# Altium schematic sheet USBC-US-100W-PD.SchDoc
size A3; SheetNumber: 1; SheetTotal: 4
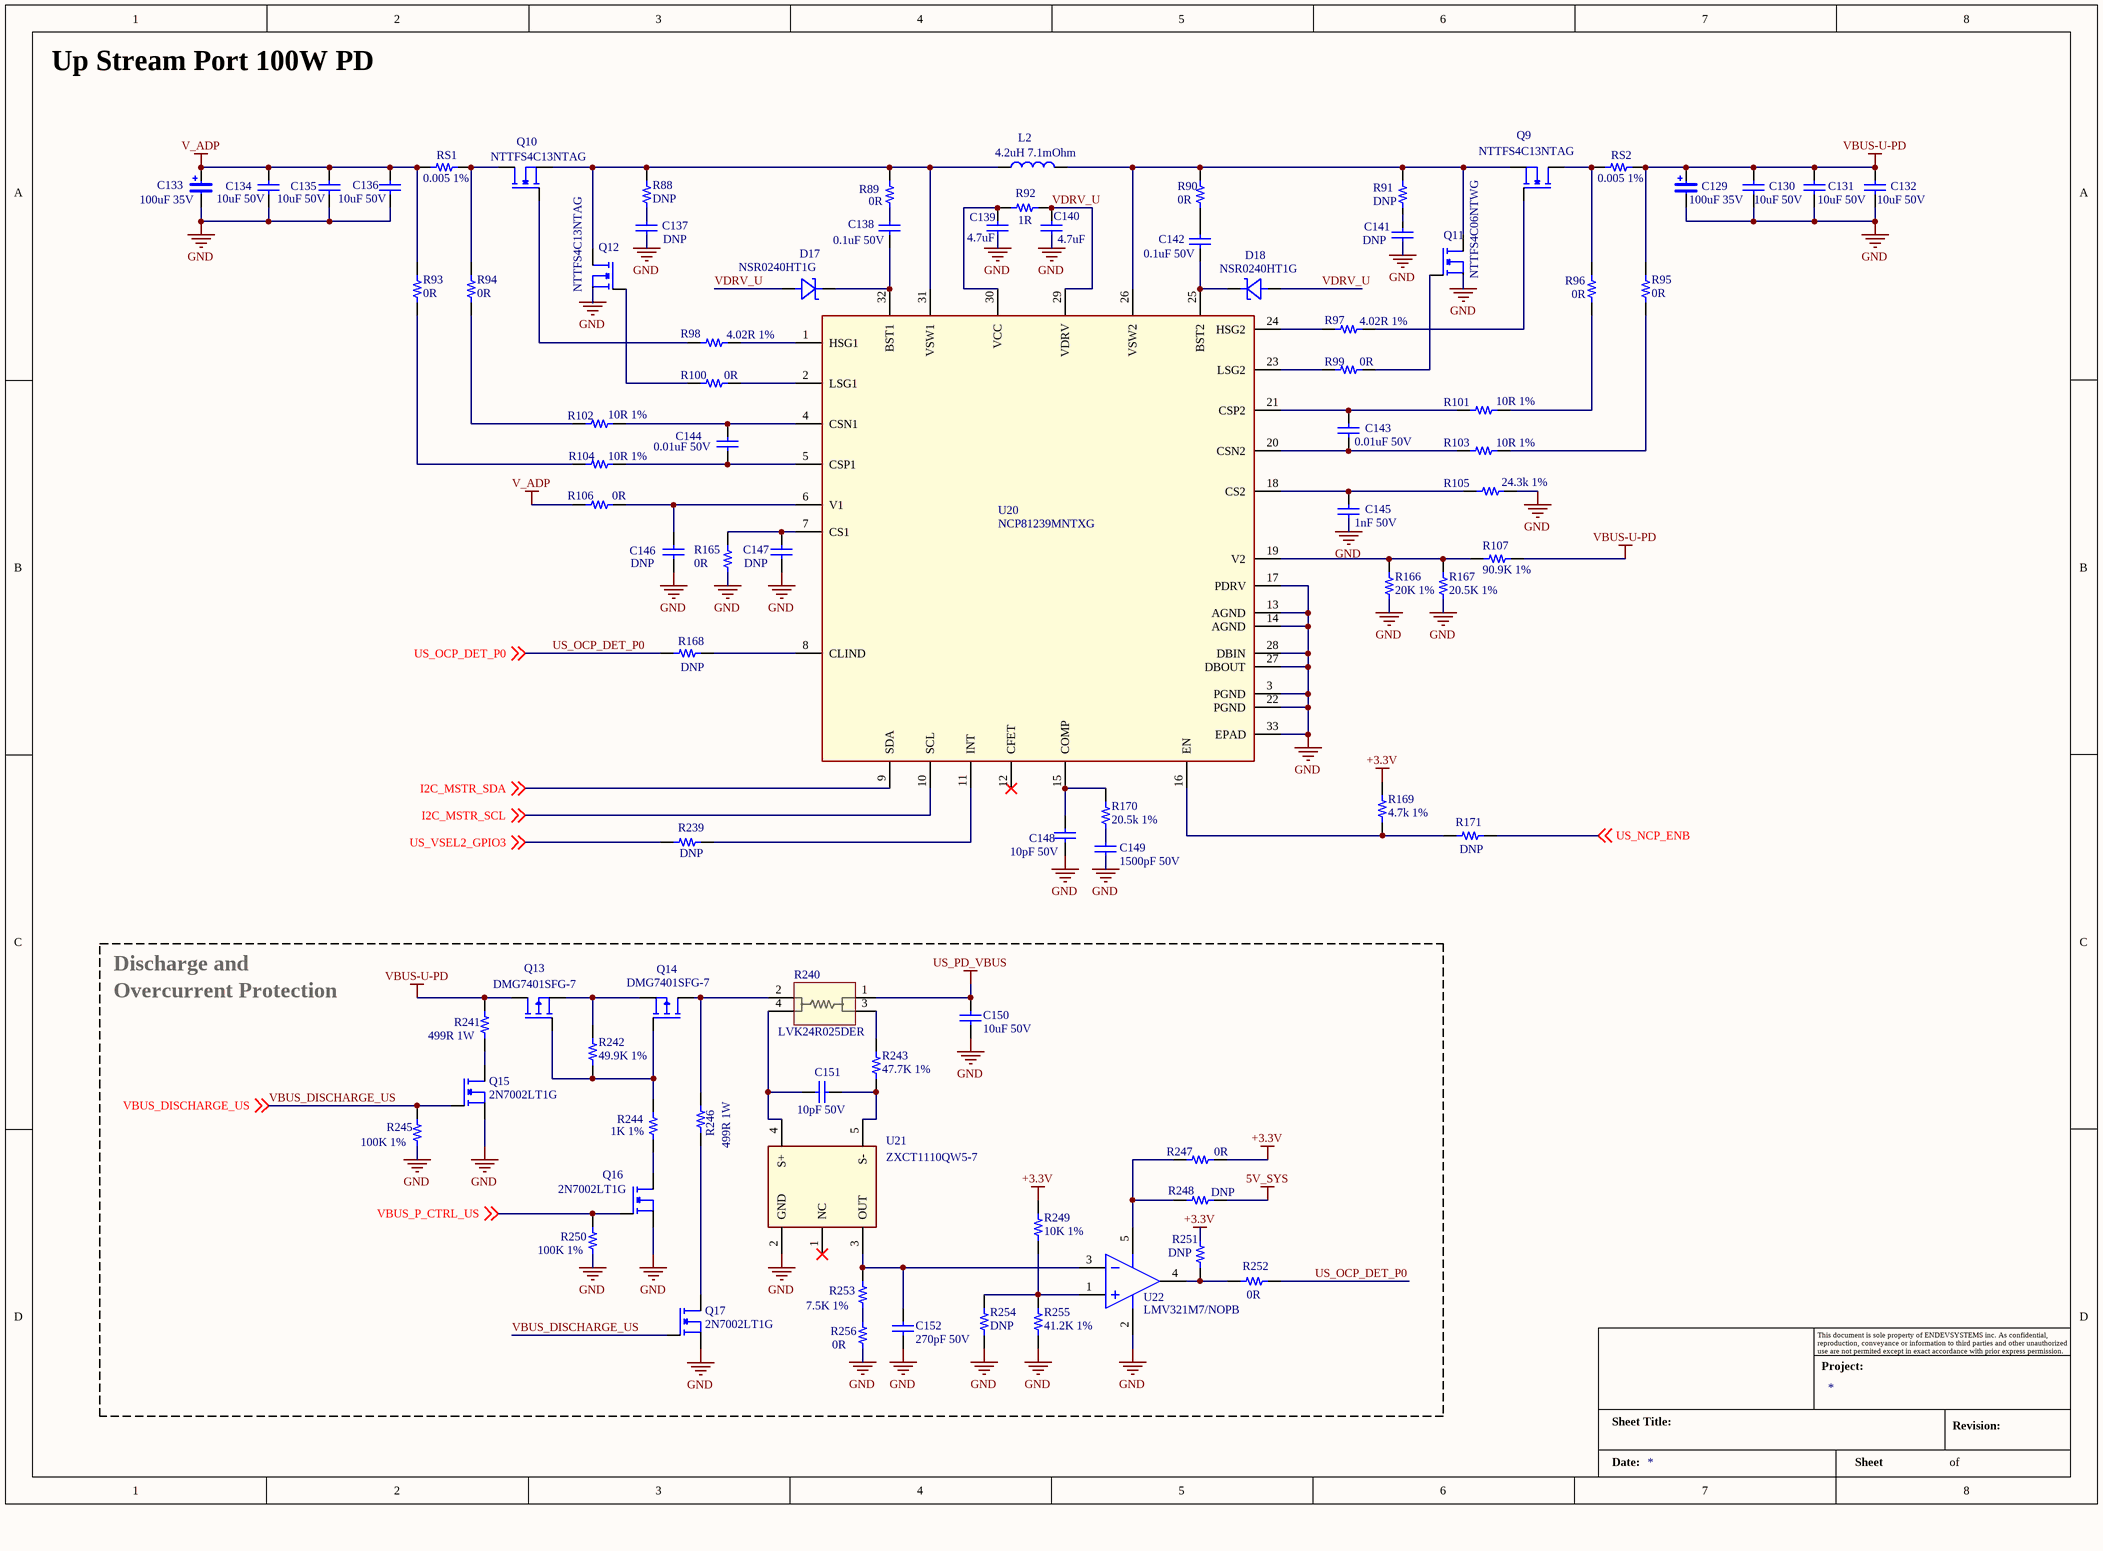
[diagram p0: USBC-US-100W-PD.SchDoc]

## Parts
?  Title_Block  (value not drawn)  (graphical)
C129  100uF 35V  [C-1206 (Tantalum)]
C130  10uF 50V  [C-0402/1005]
C131  10uF 50V  [C-0402/1005]
C132  10uF 50V  [C-0402/1005]
C133  100uF 35V  [C-1206 (Tantalum)]
C134  10uF 50V  [C-0402/1005]
C135  10uF 50V  [C-0402/1005]
C136  10uF 50V  [C-0402/1005]
C137  DNP  [C-0402/1005]
C138  0.1uF 50V  [C-0402/1005]
C139  4.7uF  [C-0402/1005]
C140  4.7uF  [C-0402/1005]
C141  DNP  [C-0402/1005]
C142  0.1uF 50V  [C-0402/1005]
C143  0.01uF 50V  [C-0402/1005]
C144  0.01uF 50V  [C-0402/1005]
C145  1nF 50V  [C-0402/1005]
C146  DNP  [C-0402/1005]
C147  DNP  [C-0402/1005]
C148  10pF 50V  [C-0402/1005]
C149  1500pF 50V  [C-0402/1005]
C150  value 10uF 50V  [C-0402/1005]  (hidden comment: 0.1uF)
C151  value 10pF 50V  [C-0402/1005]  (hidden comment: 0.1uF)
C152  value 270pF 50V  [C-0402/1005]  (hidden comment: 0.1uF)
D17  NSR0240HT1G  [SOIC-8 (W3.9mm) B]
D18  NSR0240HT1G  [SOIC-8 (W3.9mm) B]
L2  4.2uH 7.1mOhm  [4.3x4.3mm]
Q9  NTTFS4C13NTAG
Q10  NTTFS4C13NTAG
Q11  NTTFS4C06NTWG
Q12  NTTFS4C13NTAG
Q13  DMG7401SFG-7
Q14  DMG7401SFG-7
Q15  2N7002LT1G
Q16  2N7002LT1G
Q17  2N7002LT1G
R88  DNP  [R-0402]
R89  0R  [R-0402]
R90  0R  [R-0402]
R91  DNP  [R-0402]
R92  1R  [R-0402]
R93  0R  [R-0402]
R94  0R  [R-0402]
R95  0R  [R-0402]
R96  0R  [R-0402]
R97  4.02R 1%  [R-0402]
R98  4.02R 1%  [R-0402]
R99  0R  [R-0402]
R100  0R  [R-0402]
R101  10R 1%  [R-0402]
R102  10R 1%  [R-0402]
R103  10R 1%  [R-0402]
R104  10R 1%  [R-0402]
R105  24.3k 1%  [R-0402]
R106  0R  [R-0402]
R107  90.9K 1%  [R-0402]
R165  0R  [R-0402]
R166  20K 1%  [R-0402]
R167  20.5K 1%  [R-0402]
R168  DNP  [R-0402]
R169  4.7k 1%  [R-0402]
R170  20.5k 1%  [R-0402]
R171  DNP  [R-0402]
R239  DNP  [R-0402]
R240  LVK24R025DER  [LVK24_OHM]
R241  499R 1W  [R-0402]
R242  49.9K 1%  [R-0402]
R243  47.7K 1%  [R-0402]
R244  1K 1%  [R-0402]
R245  100K 1%  [R-0402]
R246  499R 1W  [R-0402]
R247  0R  [R-0402]
R248  DNP  [R-0402]
R249  10K 1%  [R-0402]
R250  100K 1%  [R-0402]
R251  DNP  [R-0402]
R252  0R  [R-0402]
R253  7.5K 1%  [R-0402]
R254  DNP  [R-0402]
R255  41.2K 1%  [R-0402]
R256  0R  [R-0402]
RS1  0.005 1%  [R-0402]
RS2  0.005 1%  [R-0402]
U20  NCP81239MNTXG  [QFN32_5X5_ONS]
U21  ZXCT1110QW5-7  [MSOP-10-W3mm]
U22  LMV321M7/NOPB  [DCK0005A_M]

## Nets
5V_SYS: R248.1
+3.3V: R169.1 R247.1 R249.2 R251.2
GND: C129.- C130.1 C131.1 C132.1 C133.- C134.1 C135.1 C136.1 C137.1 C139.1 C140.1 C141.1 C145.1 C146.1 C147.1 C148.1 C149.1 C150.2 C152.2 Q11.2(S) Q12.2(S) Q15.2(S) Q16.2(S) Q17.2(S) R105.2 R165.2 R166.2 R167.2 R245.1 R250.1 R254.1 R255.1 R256.1 U20.3(PGND) U20.13(AGND) U20.14(AGND) U20.17(PDRV) U20.22(PGND) U20.27(DBOUT) U20.28(DBIN) U20.33(EPAD) U21.2(GND) U22.2(V-)
US_PD_VBUS: C150.1 R240.1(E1)
V_ADP: C133.+ C134.2 C135.2 C136.2 R93.1 R106.2 RS1.1
VBUS-U-PD: C129.+ C130.2 C131.2 C132.2 Q13.3 R95.2 R107.2 R241.2 RS2.2
I2C_MSTR_SCL: U20.10(SCL) ; off-sheet I2C_MSTR_SCL
I2C_MSTR_SDA: U20.9(SDA) ; off-sheet I2C_MSTR_SDA
US_NCP_ENB: R171.2 ; off-sheet US_NCP_ENB
US_OCP_DET_P0: R168.2 R252.1 ; off-sheet US_OCP_DET_P0
US_VSEL2_GPIO3: R239.2 ; off-sheet US_VSEL2_GPIO3
VBUS_DISCHARGE_US: Q15.1(G) Q17.1(G) R245.2 ; off-sheet VBUS_DISCHARGE_US
VBUS_P_CTRL_US: Q16.1(G) R250.2 ; off-sheet VBUS_P_CTRL_US
VDRV_U: C140.2 D17.A D18.A R92.1 U20.29(VDRV)
NetC137_2: C137.2 R88.1
NetC138_1: C138.1 D17.C U20.32(BST1)
NetC138_2: C138.2 R89.1
NetC139_2: C139.2 R92.2 U20.30(VCC)
NetC141_2: C141.2 R91.1
NetC142_1: C142.1 D18.C U20.25(BST2)
NetC142_2: C142.2 R90.1
NetC143_1: C143.1 R103.2 U20.20(CSN2)
NetC143_2: C143.2 R101.2 U20.21(CSP2)
NetC144_1: C144.1 R104.1 U20.5(CSP1)
NetC144_2: C144.2 R102.1 U20.4(CSN1)
NetC145_2: C145.2 R105.1 U20.18(CS2)
NetC146_2: C146.2 R106.1 U20.6(V1)
NetC147_2: C147.2 R165.1 U20.7(CS1)
NetC148_2: C148.2 R170.1 U20.15(COMP)
NetC149_2: C149.2 R170.2
NetC151_1: C151.1 R243.1 U21.5(S-)
NetC151_2: C151.2 R240.4 U21.4(S+)
NetC152_1: C152.1 R253.2 U21.3(OUT) U22.3(IN-)
NetL2_1: L2.1 Q10.2(S) Q12.3(D) R88.2 R89.2 U20.31(VSW1)
NetL2_2: L2.2 Q9.2(S) Q11.3(D) R90.2 R91.2 U20.26(VSW2)
NetQ9_1: Q9.1(G) R97.1
NetQ9_3: Q9.3(D) R96.2 RS2.1
NetQ10_1: Q10.1(G) R98.2
NetQ10_3: Q10.3(D) R94.1 RS1.2
NetQ11_1: Q11.1(G) R99.1
NetQ12_1: Q12.1(G) R100.2
NetQ13_1: Q13.1 Q14.1 R242.1 R244.2
NetQ13_2: Q13.2 Q14.2 R242.2
NetQ14_3: Q14.3 R240.2(E2) R246.2
NetQ15_3: Q15.3(D) R241.1
NetQ16_3: Q16.3(D) R244.1
NetQ17_3: Q17.3(D) R246.1
NetR93_2: R93.2 R104.2
NetR94_2: R94.2 R102.2
NetR95_1: R95.1 R103.1
NetR96_1: R96.1 R101.1
NetR97_2: R97.2 U20.24(HSG2)
NetR98_1: R98.1 U20.1(HSG1)
NetR99_2: R99.2 U20.23(LSG2)
NetR100_1: R100.1 U20.2(LSG1)
NetR107_1: R107.1 R166.1 R167.1 U20.19(V2)
NetR168_1: R168.1 U20.8(CLIND)
NetR169_2: R169.2 R171.1 U20.16(EN)
NetR239_1: R239.1 U20.11(INT)
NetR240_3: R240.3 R243.2
NetR247_2: R247.2 R248.2 U22.5(V+)
NetR249_1: R249.1 R254.2 R255.2 U22.1(IN+)
NetR251_1: R251.1 R252.2 U22.4(OUT)
NetR253_1: R253.1 R256.2

Not connected (* = marked no-connect by the designer): U20 12(CFET)*; U21 1(NC)*

## Notes on the sheet
- Up Stream Port 100W PD
- Discharge and
- Overcurrent Protection
- (in symbol Title_Block) This document is sole property of ENDEVSYSTEMS inc. As confidential, reproduction, conveyance or information to third parties and other unauthorized use are not permited except in exact accordance with prior express permission.; Project:; Sheet Title:; Revision:; Date:; Sheet; of

## Library data of the parts
C129 C133 = Capacitor-Polar: CAP TANT 10UF 10% 16V 1206; Mfr. Part No.: F931C106KAAAJ6; Unit Price (USD): 0.67; Value: 10uF 16V; Supplier Part No.: 478-10723-1-ND; Supplier: Digikey Electronics
C130-C132 C134-C137 C139-C141 C143-C149 = Cap: Capacitor; Value: 0.1uF; Published: 8-Jun-2000; LatestRevisionDate: 17-Jul-2002; LatestRevisionNote: Re-released for DXP Platform.; PackageReference: RAD-0.3; Publisher: Altium Limited; PackageDescription: Radial Cap, Thru-Hole; 2 Leads; 0.3 in Pin Spacing
C138 C142 C150-C152 = Cap: Capacitor; Published: 8-Jun-2000; LatestRevisionDate: 17-Jul-2002; LatestRevisionNote: Re-released for DXP Platform.; PackageReference: RAD-0.3; Publisher: Altium Limited; PackageDescription: Radial Cap, Thru-Hole; 2 Leads; 0.3 in Pin Spacing
  C138 C142: Value: 0.1uF
D17 D18 = Diode-Schottky: Supplier: Digikey Electronics
L2 = 4.3x4.3mm: FIXED IND 22UH 620MA 350 MOHM; Mfr. Part No.: ASPI-4020S-220M-T; Unit Price (USD): 0.48; Supplier Part No.: 535-12307-1-ND; Value: 22uH; Supplier: Digikey Electronics
Q9-Q12 Q15-Q17 = MOSFET-N: Supplier: Digikey Electronics
Q13 Q14 = MOSFET-P: Supplier: Digikey Electronics
R88-R107 R165-R171 R239 R241-R256 RS1 RS2 = Resistor: RES SMD 51 OHM 0.5% 1/16W 0402; Mfr. Part No.: ERA-2AED510X; Value: 51R; Unit Price (USD): 0.21; Supplier Part No.: P51DECT-ND; Supplier: Digikey Electronics
R240 = LVK24R025DER: No Description Available; Mfr_Name: Ohmite; RefDes: RefDes; Type: Type
U20 = NCP81239MNTXG: No Description Available; Mfr_Name: onsemi; RefDes: RefDes; Type: Type
U21 = LT8607EMSE#PBF: IC REG BUCK ADJ 750MA 8DFN; Mfr. Part No.: LT8607EDC#TRMPBF; Unit Price (USD): 5.48; Supplier: Digikey Electronics; Supplier Part No.: LT8607EMSE#PBF-ND
U22 = CMP-0055-01046-3: General Purpose, Low Voltage, Rail-to-Rail Output Operational Amplifiers, 5-pin SC-70, Pb-Free; Manufacturer: Texas Instruments; PackageTopMarking: A12*XTT; PowerWise: N; CompType: Amplifiers; ComponentLink1Description: Datasheet URL; Code_JEITA: SC-88A; ComponentLink1URL: http://www.ti.com/general/docs/lit/getliterature.tsp?genericPartNumber=LMV321-N&fileType=pdf; Code_IPC: SOT353-5; PinCount: 5; RoHS: Y; Code_JEDEC: MO-203-AA; PackageDescription: Molded SC-70, 2 x 1.25 x .9mm, 5 Lead, 0.65mm Pitch; Package Reference: DCK0005A
? = Title_Block: Date:: *; Project:: *